# Altium schematic sheet Title_Page.SchDoc
size Tabloid; SheetNumber: 1; SheetTotal: 5; Sheet_Name: Title Page; Size: 11x17
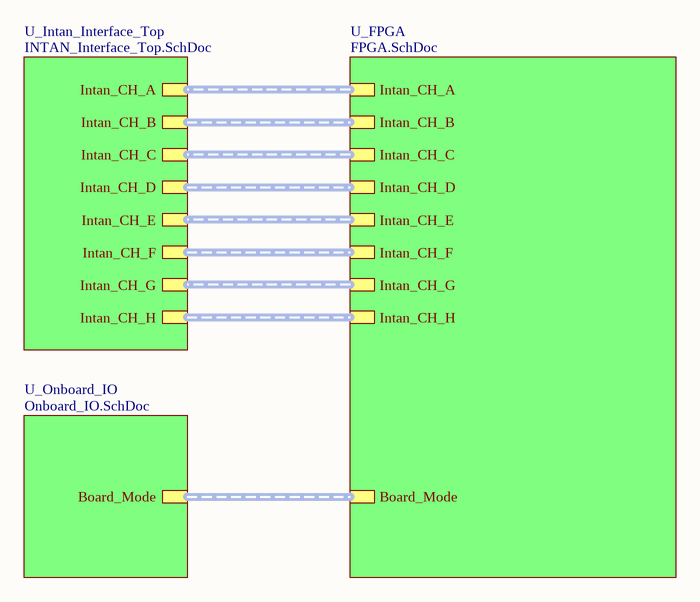
[diagram p0: Title_Page.SchDoc]

## Sub-sheets
U_FPGA = FPGA.SchDoc: Board_Mode (harness Board_Mode), Intan_CH_A (harness Intan_CH), Intan_CH_B (harness Intan_CH), Intan_CH_C (harness Intan_CH), Intan_CH_D (harness Intan_CH), Intan_CH_E (harness Intan_CH), Intan_CH_F (harness Intan_CH), Intan_CH_G (harness Intan_CH), Intan_CH_H (harness Intan_CH)
U_Intan_Interface_Top = INTAN_Interface_Top.SchDoc: Intan_CH_A (harness Intan_CH), Intan_CH_B (harness Intan_CH), Intan_CH_C (harness Intan_CH), Intan_CH_D (harness Intan_CH), Intan_CH_E (harness Intan_CH), Intan_CH_F (harness Intan_CH), Intan_CH_G (harness Intan_CH), Intan_CH_H (harness Intan_CH)
U_Onboard_IO = Onboard_IO.SchDoc: Board_Mode (harness Board_Mode)

## Buses and harness runs
harness sheet U_FPGA/Board_Mode = sheet U_Onboard_IO/Board_Mode
harness sheet U_FPGA/Intan_CH_A = sheet U_Intan_Interface_Top/Intan_CH_A
harness sheet U_FPGA/Intan_CH_B = sheet U_Intan_Interface_Top/Intan_CH_B
harness sheet U_FPGA/Intan_CH_C = sheet U_Intan_Interface_Top/Intan_CH_C
harness sheet U_FPGA/Intan_CH_D = sheet U_Intan_Interface_Top/Intan_CH_D
harness sheet U_FPGA/Intan_CH_E = sheet U_Intan_Interface_Top/Intan_CH_E
harness sheet U_FPGA/Intan_CH_F = sheet U_Intan_Interface_Top/Intan_CH_F
harness sheet U_FPGA/Intan_CH_G = sheet U_Intan_Interface_Top/Intan_CH_G
harness sheet U_FPGA/Intan_CH_H = sheet U_Intan_Interface_Top/Intan_CH_H

## Notes on the sheet
- Sheet Name
- Project Title
- Global Project
- Size
- Group
- Revision
- Date
- Sheet
- of
- Filename
- Designers